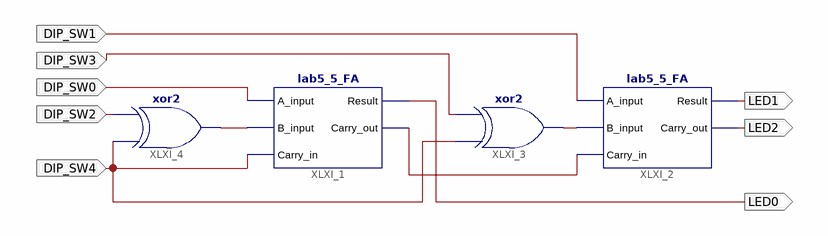
[diagram p0: schematic sheet 1]
// Xilinx ISE schematic lab5_6_fas.sch (spartan3) as structural Verilog: 4 symbols, 8 ports
module lab5_6_fas (
  input  DIP_SW1,
  input  DIP_SW3,
  input  DIP_SW0,
  input  DIP_SW4,
  input  DIP_SW2,
  output LED0,
  output LED1,
  output LED2
);

  wire USER1, XLXN_4, XLXN_8;

  lab5_5_FA XLXI_1 (.A_input(DIP_SW0), .B_input(XLXN_4), .Carry_in(DIP_SW4), .Carry_out(USER1), .Result(LED0));
  lab5_5_FA XLXI_2 (.A_input(DIP_SW1), .B_input(XLXN_8), .Carry_in(USER1), .Carry_out(LED2), .Result(LED1));
  xor XLXI_3 (XLXN_8, DIP_SW4, DIP_SW3);
  xor XLXI_4 (XLXN_4, DIP_SW4, DIP_SW2);
endmodule
